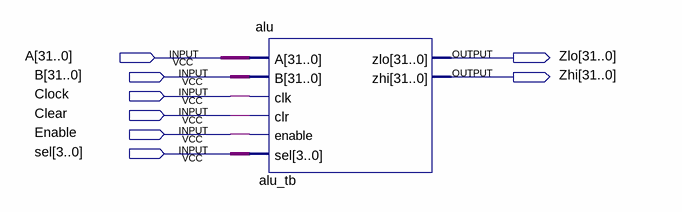
[diagram p0: schematic sheet]
// Quartus schematic alu.bdf as structural Verilog: 1 symbols, 8 pins
module alu (
  input  [31:0] A,
  input  [31:0] B,
  input  Clock,
  input  Clear,
  input  Enable,
  input  [3:0] sel,
  output [31:0] Zlo,
  output [31:0] Zhi
);

  alu alu_tb (.A(A), .B(B), .clk(Clock), .clr(Clear), .enable(Enable), .sel(sel), .zlo(Zlo), .zhi(Zhi));
endmodule
